# Altium project MB1605.PrjPcb (part 1 of 7)
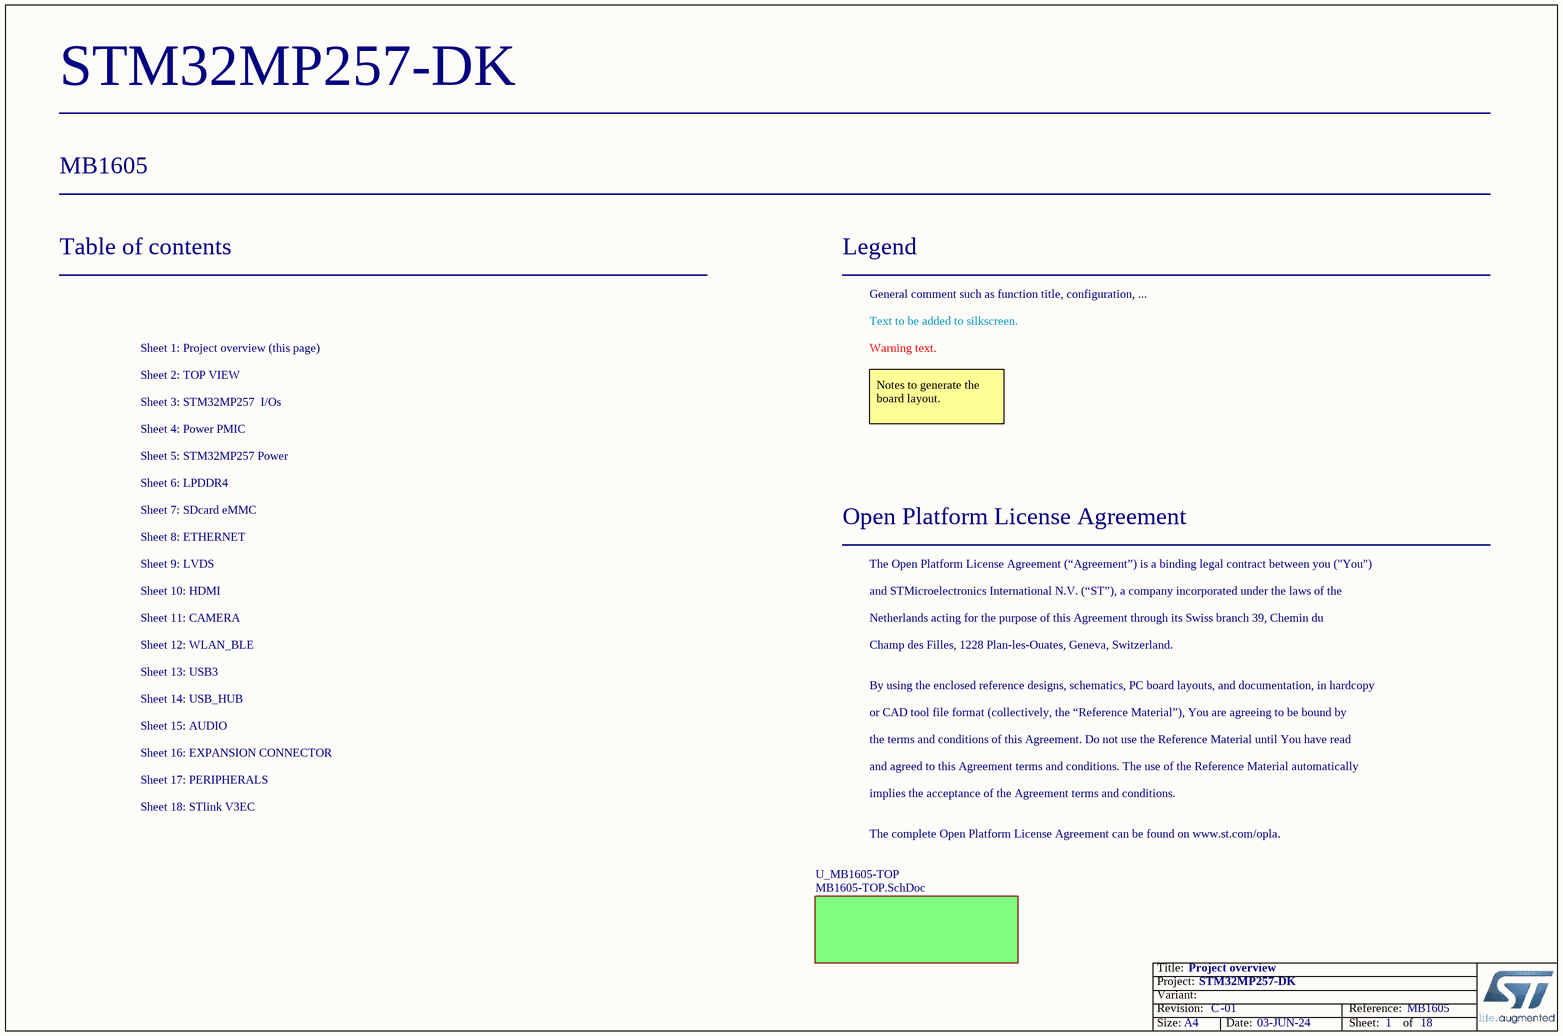
[diagram p0: MB1605_Project_Overview.SchDoc]
Board_Assembly_Revision: 01; Board_Document_Date: 03-JUN-24; Board_Name: STM32MP257-DK; Board_PCB_Revision: C; Board_Reference: MB1605
18 sheets, 641 parts. Net scope: flat (ports and power ports of the same name join across sheets).
Board file: MB1605.PcbDoc
Sheets:
  MB1605_Project_Overview.SchDoc
    U_MB1605-TOP = MB1605-TOP.SchDoc
      U_WLAN_BLUETOOTH = WLAN_BLUETOOTH.SchDoc
      U_Peripherals = Peripherals.SchDoc
      U_MP257_14x14 = MP257_14x14.SchDoc
      U_Power_PMIC = Power_PMIC.SchDoc
      U_Power_MPU = Power_MPU.SchDoc
      U_LVDS = LVDS.SchDoc
      U_STLINK_V3EC = STLINK_V3EC.SchDoc
      U_USB_HUB = USB_HUB.SchDoc
      U_USB3 = USB3.SchDoc
      U_CAMERA = CAMERA.SchDoc
      U_AUDIO = AUDIO.SchDoc
      U_Expansion_Connector = Expansion_Connector.SchDoc
      U_LPDDR4 = LPDDR4.SchDoc
      U_SDcard_eMMC = SDcard_eMMC.SchDoc
      U_ETHERNET = ETHERNET.SchDoc
      U_HDMI = HDMI.SchDoc

## Sheet MB1605_Project_Overview.SchDoc: Project overview
size A4; Date: Not used; ApprovedBy: Not used; CheckedBy: Not used; Author: Not used; CompanyName: STMicroelectronics; DrawnBy: Not used; Engineer: Not used; Organization: Not used; Address1: Not used; Address2: Not used; Address3: Not used; Address4: Not used; DocumentNumber: Not used; Revision: Not used; SheetNumber: 1; SheetTotal: 18; CurrentTime: Not used; CurrentDate: Not used; Time: Not used; DocumentFullPathAndName: Not used; DocumentName: Not used; ModifiedDate: Not used; ImagePath: Not used; ProjectName: Not used; Application_BuildNumber: Not used

### Sub-sheets
U_MB1605-TOP = MB1605-TOP.SchDoc: no entries

### Notes on the sheet
- Table of contents
- Legend
- General comment such as function title, configuration, ...
- Sheet 1: Project overview (this page)
- Sheet 2: TOP VIEW
- Text to be added to silkscreen.
- Warning text.
- Sheet 3: STM32MP257  I/Os
- Sheet 4: Power PMIC
- Notes to generate the board layout.
- Sheet 5: STM32MP257 Power
- Sheet 7: SDcard eMMC
- Sheet 6: LPDDR4
- Sheet 8: ETHERNET
- Sheet 9: LVDS
- Open Platform License Agreement
- The Open Platform License Agreement (“Agreement”) is a binding legal contract between you ("You")
- Sheet 10: HDMI
- Sheet 11: CAMERA
- Sheet 12: WLAN_BLE
- and STMicroelectronics International N.V. (“ST”), a company incorporated under the laws of the
- Netherlands acting for the purpose of this Agreement through its Swiss branch 39, Chemin du
- Champ des Filles, 1228 Plan-les-Ouates, Geneva, Switzerland.
- Sheet 13: USB3
- Sheet 14: USB_HUB
- By using the enclosed reference designs, schematics, PC board layouts, and documentation, in hardcopy
- or CAD tool file format (collectively, the “Reference Material”), You are agreeing to be bound by
- Sheet 17: PERIPHERALS
- Sheet 16: EXPANSION CONNECTOR
- Sheet 15: AUDIO
- the terms and conditions of this Agreement. Do not use the Reference Material until You have read
- and agreed to this Agreement terms and conditions. The use of the Reference Material automatically
- Sheet 18: STlink V3EC
- implies the acceptance of the Agreement terms and conditions.
- The complete Open Platform License Agreement can be found on www.st.com/opla.
- Title:
- Project:
- Size:
- Revision:
- Variant:
- A4
- -
- Date:
- Reference:
- Sheet:
- of

## Sheet MB1605-TOP.SchDoc: MB1605-TOP
size A3; Date: Not used; ApprovedBy: Not used; CheckedBy: Not used; Author: Not used; CompanyName: STMicroelectronics; DrawnBy: Not used; Engineer: Not used; Organization: Not used; Address1: Not used; Address2: Not used; Address3: Not used; Address4: Not used; DocumentNumber: Not used; Revision: Not used; SheetNumber: 2; SheetTotal: 18; CurrentTime: Not used; CurrentDate: Not used; Time: Not used; DocumentFullPathAndName: Not used; DocumentName: Not used; ModifiedDate: Not used; ImagePath: Not used; ProjectName: Not used; Application_BuildNumber: Not used
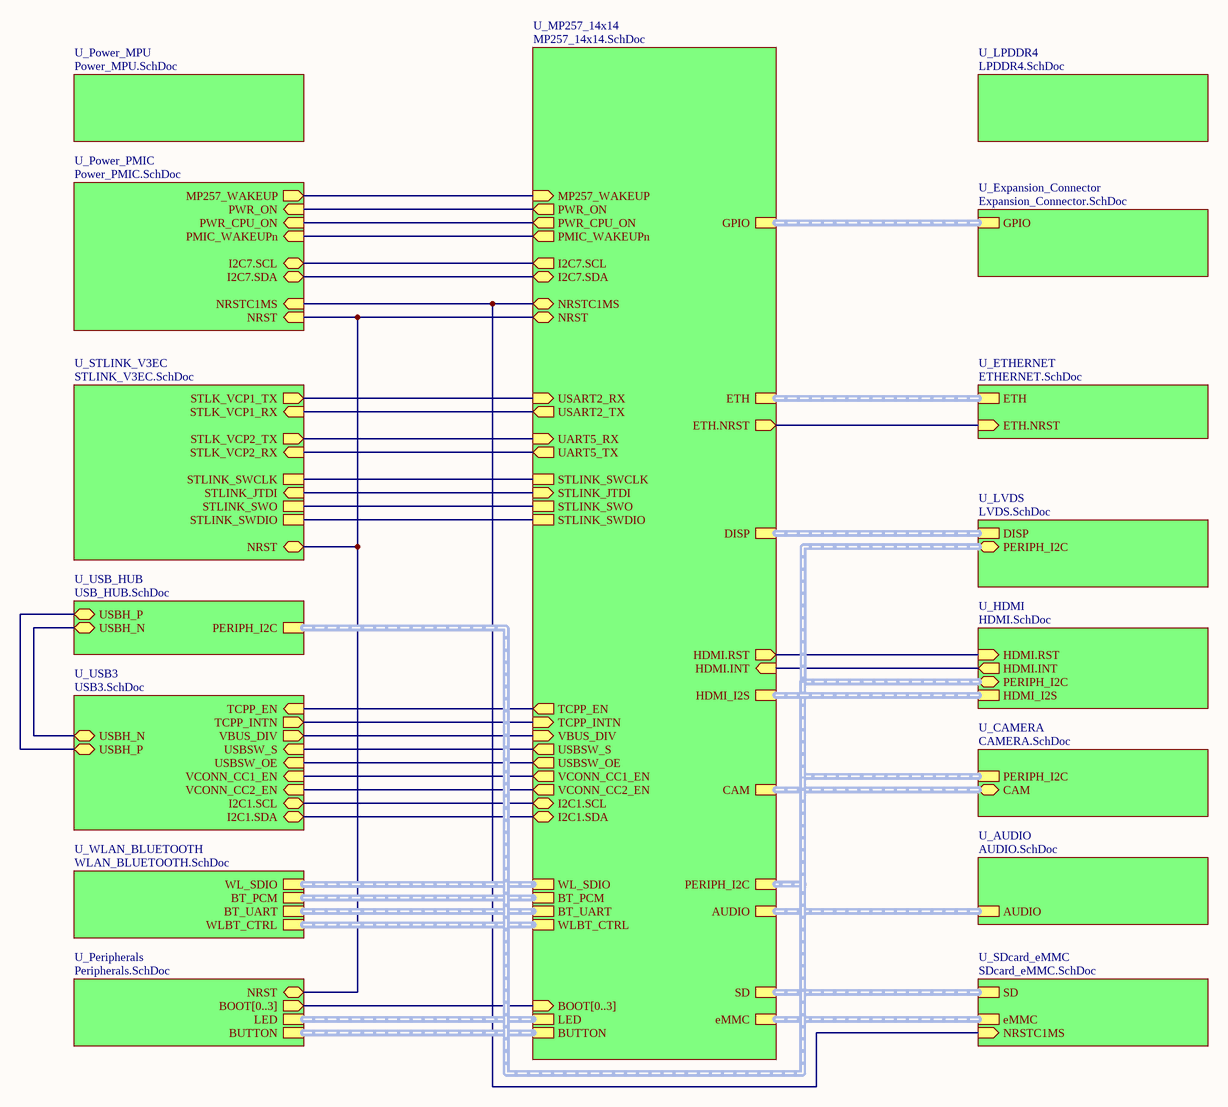
[diagram p1: MB1605-TOP.SchDoc]

### Sub-sheets
U_AUDIO = AUDIO.SchDoc: AUDIO (harness AUDIO)
U_CAMERA = CAMERA.SchDoc: CAM (bidir, harness CAMERA), PERIPH_I2C (harness PERIPH_I2C)
U_ETHERNET = ETHERNET.SchDoc: ETH.NRST (in), ETH (harness ETH1)
U_Expansion_Connector = Expansion_Connector.SchDoc: GPIO (harness GPIO)
U_HDMI = HDMI.SchDoc: HDMI.RST (in), HDMI.INT (out), PERIPH_I2C (bidir, harness PERIPH_I2C), HDMI_I2S (harness HDMI_I2S)
U_LPDDR4 = LPDDR4.SchDoc: no entries
U_LVDS = LVDS.SchDoc: DISP (harness DISP), PERIPH_I2C (bidir, harness PERIPH_I2C)
U_MP257_14x14 = MP257_14x14.SchDoc: NRST (bidir), PWR_ON (out), ETH (harness ETH1), BOOT[0..3] (in), LED (harness LED), BUTTON (harness BUTTON), UART5_TX (out), UART5_RX (in), STLINK_SWCLK, STLINK_JTDI (in), STLINK_SWO, STLINK_SWDIO, USART2_RX (in), NRSTC1MS (bidir), VBUS_DIV (in), TCPP_INTN (in), GPIO (harness GPIO), I2C7.SDA (bidir), I2C7.SCL (out), USART2_TX (out), DISP (harness DISP), PERIPH_I2C (harness PERIPH_I2C), ETH.NRST (out), I2C1.SCL (bidir), HDMI_I2S (harness HDMI_I2S), I2C1.SDA (bidir), PWR_CPU_ON (out), CAM (harness CAMERA), SD (harness SD), WL_SDIO (harness WL_SDIO), BT_PCM (harness BT_PCM), WLBT_CTRL (harness WL_BT_CTRL), BT_UART (harness BT_UART), AUDIO (harness AUDIO), MP257_WAKEUP (in), PMIC_WAKEUPn (out), HDMI.INT (in), HDMI.RST (out), USBSW_OE (out), USBSW_S (out), eMMC (harness eMMC), TCPP_EN (out), VCONN_CC1_EN (out), VCONN_CC2_EN (out)
U_Peripherals = Peripherals.SchDoc: NRST (bidir), BOOT[0..3] (out), LED (harness LED), BUTTON (harness BUTTON)
U_Power_MPU = Power_MPU.SchDoc: no entries
U_Power_PMIC = Power_PMIC.SchDoc: PMIC_WAKEUPn (in), NRST (in), I2C7.SCL (bidir), PWR_ON (in), PWR_CPU_ON (in), NRSTC1MS (in), I2C7.SDA (bidir), MP257_WAKEUP (out)
U_SDcard_eMMC = SDcard_eMMC.SchDoc: SD (harness SD), eMMC (harness eMMC), NRSTC1MS (in)
U_STLINK_V3EC = STLINK_V3EC.SchDoc: NRST (bidir), STLK_VCP2_TX (out), STLK_VCP2_RX (in), STLK_VCP1_TX (out), STLK_VCP1_RX (in), STLINK_SWO, STLINK_SWDIO, STLINK_SWCLK, STLINK_JTDI (in)
U_USB3 = USB3.SchDoc: TCPP_INTN (out), I2C1.SDA (bidir), I2C1.SCL (bidir), VBUS_DIV (out), USBH_P (bidir), USBH_N (bidir), USBSW_OE (in), USBSW_S (in), TCPP_EN (in), VCONN_CC1_EN (in), VCONN_CC2_EN (in)
U_USB_HUB = USB_HUB.SchDoc: USBH_P (bidir), USBH_N (bidir), PERIPH_I2C (harness PERIPH_I2C)
U_WLAN_BLUETOOTH = WLAN_BLUETOOTH.SchDoc: BT_PCM (harness BT_PCM), BT_UART (harness BT_UART), WL_SDIO (harness WL_SDIO), WLBT_CTRL (harness WL_BT_CTRL)

### Nets
(unnamed): sheet U_Peripherals/NRST, sheet U_MP257_14x14/NRST, sheet U_Power_PMIC/NRST, sheet U_STLINK_V3EC/NRST
(unnamed): sheet U_MP257_14x14/PWR_ON, sheet U_Power_PMIC/PWR_ON
(unnamed): sheet U_MP257_14x14/UART5_TX, sheet U_STLINK_V3EC/STLK_VCP2_RX
(unnamed): sheet U_MP257_14x14/UART5_RX, sheet U_STLINK_V3EC/STLK_VCP2_TX
(unnamed): sheet U_MP257_14x14/STLINK_SWCLK, sheet U_STLINK_V3EC/STLINK_SWCLK
(unnamed): sheet U_MP257_14x14/STLINK_JTDI, sheet U_STLINK_V3EC/STLINK_JTDI
(unnamed): sheet U_MP257_14x14/STLINK_SWO, sheet U_STLINK_V3EC/STLINK_SWO
(unnamed): sheet U_MP257_14x14/STLINK_SWDIO, sheet U_STLINK_V3EC/STLINK_SWDIO
(unnamed): sheet U_MP257_14x14/USART2_RX, sheet U_STLINK_V3EC/STLK_VCP1_TX
(unnamed): sheet U_MP257_14x14/NRSTC1MS, sheet U_Power_PMIC/NRSTC1MS, sheet U_SDcard_eMMC/NRSTC1MS
(unnamed): sheet U_MP257_14x14/VBUS_DIV, sheet U_USB3/VBUS_DIV
(unnamed): sheet U_MP257_14x14/TCPP_INTN, sheet U_USB3/TCPP_INTN
(unnamed): sheet U_MP257_14x14/I2C7.SDA, sheet U_Power_PMIC/I2C7.SDA
(unnamed): sheet U_MP257_14x14/I2C7.SCL, sheet U_Power_PMIC/I2C7.SCL
(unnamed): sheet U_MP257_14x14/USART2_TX, sheet U_STLINK_V3EC/STLK_VCP1_RX
(unnamed): sheet U_MP257_14x14/ETH.NRST, sheet U_ETHERNET/ETH.NRST
(unnamed): sheet U_MP257_14x14/I2C1.SCL, sheet U_USB3/I2C1.SCL
(unnamed): sheet U_MP257_14x14/I2C1.SDA, sheet U_USB3/I2C1.SDA
(unnamed): sheet U_MP257_14x14/PWR_CPU_ON, sheet U_Power_PMIC/PWR_CPU_ON
(unnamed): sheet U_MP257_14x14/MP257_WAKEUP, sheet U_Power_PMIC/MP257_WAKEUP
(unnamed): sheet U_MP257_14x14/PMIC_WAKEUPn, sheet U_Power_PMIC/PMIC_WAKEUPn
(unnamed): sheet U_MP257_14x14/HDMI.INT, sheet U_HDMI/HDMI.INT
(unnamed): sheet U_MP257_14x14/HDMI.RST, sheet U_HDMI/HDMI.RST
(unnamed): sheet U_MP257_14x14/USBSW_OE, sheet U_USB3/USBSW_OE
(unnamed): sheet U_MP257_14x14/USBSW_S, sheet U_USB3/USBSW_S
(unnamed): sheet U_MP257_14x14/TCPP_EN, sheet U_USB3/TCPP_EN
(unnamed): sheet U_MP257_14x14/VCONN_CC1_EN, sheet U_USB3/VCONN_CC1_EN
(unnamed): sheet U_MP257_14x14/VCONN_CC2_EN, sheet U_USB3/VCONN_CC2_EN
(unnamed): sheet U_USB_HUB/USBH_P, sheet U_USB3/USBH_P
(unnamed): sheet U_USB_HUB/USBH_N, sheet U_USB3/USBH_N

### Buses and harness runs
bus sheet U_MP257_14x14/BOOT[0..3] = sheet U_Peripherals/BOOT[0..3]
harness sheet U_AUDIO/AUDIO = sheet U_MP257_14x14/AUDIO
harness sheet U_CAMERA/CAM = sheet U_MP257_14x14/CAM
harness sheet U_CAMERA/PERIPH_I2C = sheet U_HDMI/PERIPH_I2C = sheet U_LVDS/PERIPH_I2C = sheet U_MP257_14x14/PERIPH_I2C = sheet U_USB_HUB/PERIPH_I2C
harness sheet U_ETHERNET/ETH = sheet U_MP257_14x14/ETH
harness sheet U_Expansion_Connector/GPIO = sheet U_MP257_14x14/GPIO
harness sheet U_HDMI/HDMI_I2S = sheet U_MP257_14x14/HDMI_I2S
harness sheet U_LVDS/DISP = sheet U_MP257_14x14/DISP
harness sheet U_MP257_14x14/BT_PCM = sheet U_WLAN_BLUETOOTH/BT_PCM
harness sheet U_MP257_14x14/BT_UART = sheet U_WLAN_BLUETOOTH/BT_UART
harness sheet U_MP257_14x14/BUTTON = sheet U_Peripherals/BUTTON
harness sheet U_MP257_14x14/eMMC = sheet U_SDcard_eMMC/eMMC
harness sheet U_MP257_14x14/LED = sheet U_Peripherals/LED
harness sheet U_MP257_14x14/SD = sheet U_SDcard_eMMC/SD
harness sheet U_MP257_14x14/WL_SDIO = sheet U_WLAN_BLUETOOTH/WL_SDIO
harness sheet U_MP257_14x14/WLBT_CTRL = sheet U_WLAN_BLUETOOTH/WLBT_CTRL

### Notes on the sheet
- Title:
- Project:
- Size:
- Revision:
- Variant:
- A3
- -
- Date:
- Reference:
- Sheet:
- of

## Sheet WLAN_BLUETOOTH.SchDoc: WLAN_BLUETOOTH
size A4; Date: 21-MAR-2018; Author: A.B; CompanyName: STMicroelectronics; Organization: MCD/TOOLS/GNB; Address1: 12, Rue Jules HOROWITZ; Address2: 38019 Grenoble; Address3: FRANCE; DocumentNumber: MB1605; Revision: B-01; SheetNumber: 12; SheetTotal: 18; Project: STM32MP257
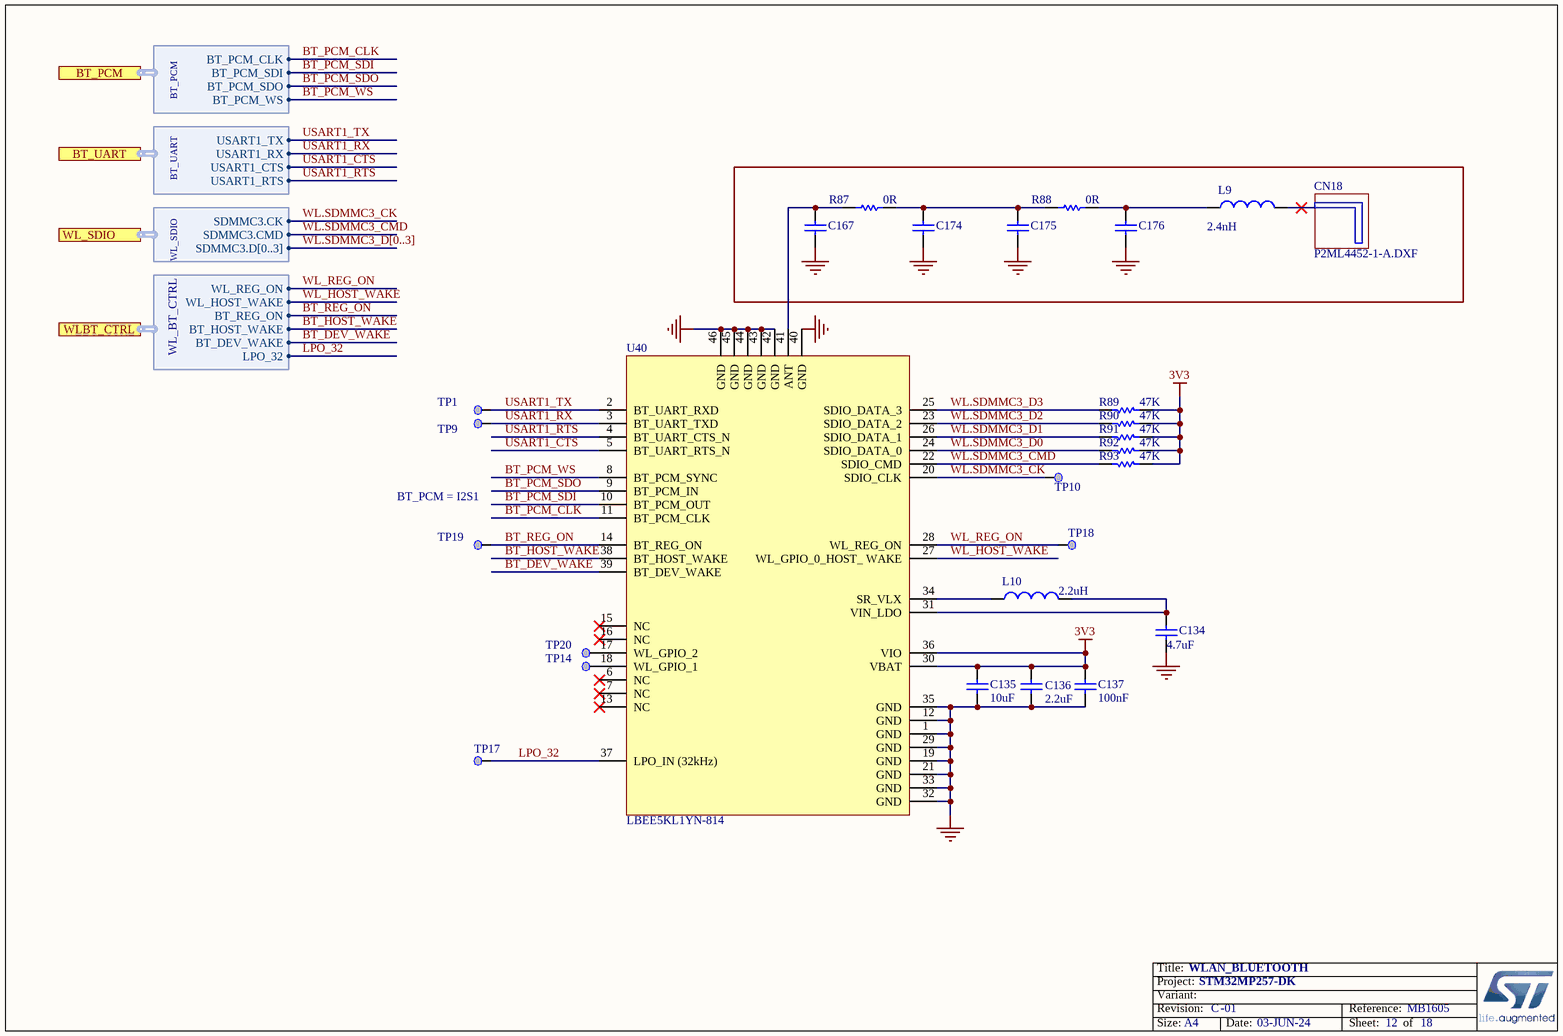
[diagram p2: WLAN_BLUETOOTH.SchDoc]

### Parts
C134  value 4.7uF  [C0402]  (hidden comment: Capacitor)
C135  value 10uF  [C0603]  (hidden comment: Capacitor)
C136  value 2.2uF  [C0603]  (hidden comment: Capacitor)
C137  value 100nF  [C0402]
C167  Capacitor  [C0402]  (value not drawn)
C174  Capacitor  [C0402]  (value not drawn)
C175  Capacitor  [C0402]  (value not drawn)
C176  Capacitor  [C0402]  (value not drawn)
CN18  value P2ML4452-1-A.DXF  [ANT_MURATA_TYPE-1-DX_P2ML4452-1-A_DXF]  (hidden comment: antenna_Wifi_BLE_Murata)  (no BOM)
L9  value 2.4nH  [IND_0402_MURATA_LQW15AN2N4C00X]  (hidden comment: Inductor)
L10  value 2.2uH  [L0603]  (hidden comment: Inductor)
R87  value 0R  [R0402]  (hidden comment: Resistor)
R88  value 0R  [R0402]  (hidden comment: Resistor)
R89  value 47K  [R0402]  (hidden comment: Resistor)
R90  value 47K  [R0402]  (hidden comment: Resistor)
R91  value 47K  [R0402]  (hidden comment: Resistor)
R92  value 47K  [R0402]  (hidden comment: Resistor)
R93  value 47K  [R0402]  (hidden comment: Resistor)
TP1  Test Point  [TP_SMD_0-6MM]  (value not drawn)  (no BOM)
TP9  Test Point  [TP_SMD_0-6MM]  (value not drawn)  (no BOM)
TP10  Test Point  [TP_SMD_0-6MM]  (value not drawn)  (no BOM)
TP14  Test Point  [TP_SMD_0-6MM]  (value not drawn)  (no BOM)
TP17  Test Point  [TP_SMD_0-6MM]  (value not drawn)  (no BOM)
TP18  Test Point  [TP_SMD_0-6MM]  (value not drawn)  (no BOM)
TP19  Test Point  [TP_SMD_0-6MM]  (value not drawn)  (no BOM)
TP20  Test Point  [TP_SMD_0-6MM]  (value not drawn)  (no BOM)
U40  LBEE5KL1YN-814  [MOD_WLAN-BT_MURATA_LBEE5KL1YN-814]

### Ports
BT_PCM (harness BT_PCM), BT_UART (harness BT_UART), WL_SDIO (harness WL_SDIO), WLBT_CTRL (harness WL_BT_CTRL)

### Harnesses
BT_PCM: BT_PCM_CLK, BT_PCM_SDI, BT_PCM_SDO, BT_PCM_WS
BT_UART: USART1_TX, USART1_RX, USART1_CTS, USART1_RTS
WL_SDIO: SDMMC3.CMD, SDMMC3.CK, SDMMC3.D[0..3]
WL_BT_CTRL: WL_REG_ON, WL_HOST_WAKE, BT_REG_ON, BT_HOST_WAKE, BT_DEV_WAKE, LPO_32

### Nets
3V3: C135.2 C136.2 C137.2 R89.1 R90.1 R91.1 R92.1 R93.1 U40.30(VBAT) U40.36(VIO)
GND: C134.1 C135.1 C136.1 C137.1 C167.1 C174.1 C175.1 C176.1 U40.1(GND) U40.12(GND) U40.19(GND) U40.21(GND) U40.29(GND) U40.32(GND) U40.33(GND) U40.35(GND) U40.40(GND) U40.42(GND) U40.43(GND) U40.44(GND) U40.45(GND) U40.46(GND)
BT_DEV_WAKE: U40.39(BT_DEV_WAKE) ; port WLBT_CTRL.BT_DEV_WAKE
BT_HOST_WAKE: U40.38(BT_HOST_WAKE) ; port WLBT_CTRL.BT_HOST_WAKE
BT_PCM_CLK: U40.11(BT_PCM_CLK) ; port BT_PCM.BT_PCM_CLK
BT_PCM_SDI: U40.10(BT_PCM_OUT) ; port BT_PCM.BT_PCM_SDI
BT_PCM_SDO: U40.9(BT_PCM_IN) ; port BT_PCM.BT_PCM_SDO
BT_PCM_WS: U40.8(BT_PCM_SYNC) ; port BT_PCM.BT_PCM_WS
BT_REG_ON: TP19.1 U40.14(BT_REG_ON) ; port WLBT_CTRL.BT_REG_ON
LPO_32: TP17.1 U40.37(LPO_IN_(32kHz)) ; port WLBT_CTRL.LPO_32
USART1_CTS: U40.5(BT_UART_RTS_N) ; port BT_UART.USART1_CTS
USART1_RTS: U40.4(BT_UART_CTS_N) ; port BT_UART.USART1_RTS
USART1_RX: TP9.1 U40.3(BT_UART_TXD) ; port BT_UART.USART1_RX
USART1_TX: TP1.1 U40.2(BT_UART_RXD) ; port BT_UART.USART1_TX
WL.SDMMC3_CK: TP10.1 U40.20(SDIO_CLK) ; port WL_SDIO.SDMMC3.CK
WL.SDMMC3_CMD: R93.2 U40.22(SDIO_CMD) ; port WL_SDIO.SDMMC3.CMD
WL.SDMMC3_D0: R92.2 U40.24(SDIO_DATA_0)
WL.SDMMC3_D1: R91.2 U40.26(SDIO_DATA_1)
WL.SDMMC3_D2: R90.2 U40.23(SDIO_DATA_2)
WL.SDMMC3_D3: R89.2 U40.25(SDIO_DATA_3)
WL_HOST_WAKE: U40.27(WL_GPIO_0_HOST__WAKE) ; port WLBT_CTRL.WL_HOST_WAKE
WL_REG_ON: TP18.1 U40.28(WL_REG_ON) ; port WLBT_CTRL.WL_REG_ON
NetC134_2: C134.2 L10.2 U40.31(VIN_LDO)
NetC167_2: C167.2 R87.2 U40.41(ANT)
NetC174_2: C174.2 C175.2 R87.1 R88.2
NetC176_2: C176.2 L9.1 R88.1
NetL10_1: L10.1 U40.34(SR_VLX)
NetTP14_1: TP14.1 U40.18(WL_GPIO_1)
NetTP20_1: TP20.1 U40.17(WL_GPIO_2)

Not connected (* = marked no-connect by the designer): L9 2*; U40 6(NC)* 7(NC)* 13(NC)* 15(NC)* 16(NC)*

### Buses and harness runs
bus WL.SDMMC3_D[0..3]

### Notes on the sheet
- (near TP19) BT_PCM = I2S1
- Title:
- Project:
- Size:
- Revision:
- Variant:
- A4
- -
- Date:
- Reference:
- Sheet:
- of

### Library data of the parts
C134 = MCD-01356: Capacitor, MLCC, 4.7uF, 6V3, X5R, 20%, 0402, T=0,5mm; Manufacturer_Part_Number: GRM155R60J475ME47; Manufacturer: MURATA; Alternate_Manufacturer_Part_Number: GRM155R60J475ME87; Part_Preference: Recommended; Provided_By: SUBCO; Order_Code_RS: 814-5230; ECCN_EU: NEC; ECCN_US: EAR99; Component_Country_Of_Origin: Japan; ID: 3456; ShowFields: YES; Internal_Part_Number: MCD-01356; ComponentLink1Description: Datasheet; Status: Released; Part_Type: Capacitor; Package: 0402; ComponentLink1URL: http://tunmcdsvn.tun.st.com/Component_Documentation_Library/Trunk/Capacitor/MURATA_GRM_Series; Alternate_Manufacturer: MURATA; Order_Code_Digikey: 490-5915-1-ND; Order_Code_Farnell: 2666407
C135 = MCD-00099: Capacitor, MLCC, 10uF, 10V, X5R, 10%, 0603, T=0,8mm; Manufacturer_Part_Number: GRM188R61A106KE69D; Manufacturer: MURATA; Part_Preference: Recommended; ECCN_US: EAR99; ECCN_EU: NEC; Provided_By: SUBCO; Initial_Board_Reference: MB1262; Order_Code_RS: 170-6168; Component_Country_Of_Origin: Japan; ID: 2770; ShowFields: YES; Internal_Part_Number: MCD-00099; Status: Released; Part_Type: Capacitor; Package: 0603; ComponentLink1Description: Datasheet; ComponentLink1URL: http://tunmcdsvn.tun.st.com/Component_Documentation_Library/Trunk/Capacitor/MURATA_GRM_Series; Order_Code_Digikey: 490-10474-1-ND; Order_Code_Farnell: 2494233
C136 = MCD-00012: Capacitor, MLCC, 2.2uF, 10V, X5R, 10%, 0603, T=0,8mm; Manufacturer_Part_Number: CC0603KRX5R6BB225; Manufacturer: YAGEO; Alternate_Manufacturer_Part_Number: C0603C225K8PACTU; Alternate_Manufacturer: KEMET; BMS_Part_Number: 9142010; Part_Preference: Recommended; ECCN_US: EAR99; ECCN_EU: NEC; Provided_By: SUBCO; Initial_Board_Reference: MB1274; Component_Country_Of_Origin: China; ID: 2467; ShowFields: YES; Internal_Part_Number: MCD-00012; ComponentLink1Description: Datasheet; Status: Released; Part_Type: Capacitor; Package: 0603; ComponentLink1URL: http://tunmcdsvn.tun.st.com/Component_Documentation_Library/Trunk/Capacitor/YAGEO_X5R_Series; Order_Code_Digikey: 311-1451-1-ND; Order_Code_Farnell: 2370679; Order_Code_RS: N/A
C137 = MCD-00006: Capacitor,100nF,16V,X7R,10%,0402; Manufacturer_Part_Number: CC0402KRX7R7BB104; Manufacturer: YAGEO; Alternate_Manufacturer: MURATA; Alternate_Manufacturer_Part_Number: GCM155R71C104KA55D; Part_Preference: Recommended; Partial_Alternate_Internal_Part_Number: MCD-03299; ECCN_US: EAR99; ECCN_EU: NEC; Provided_By: SUBCO; Initial_Board_Reference: MB1274; Order_Code_RS: 616-9701; Component_Country_Of_Origin: China; ID: 2474; ShowFields: YES; Alternate_EMS: M; Internal_Part_Number: MCD-00006; ComponentLink1Description: Datasheet; Status: Released; Part_Type: Capacitor; Package: 0402; ComponentLink1URL: http://tunmcdsvn.tun.st.com/Component_Documentation_Library/Trunk/Capacitor/YAGEO_X7R_Series; Order_Code_Digikey: 311-1338-1-ND; Order_Code_Farnell: 9402047
C167 C174-C176 = MCD-00200: Capacitor, MLCC, 12pF, 50V, NPO, 5%, 0402, T=0,5mm; Manufacturer_Part_Number: CC0402JRNPO9BN120; Manufacturer: YAGEO; Part_Preference: Recommended; Provided_By: SUBCO; ECCN_EU: NEC; ECCN_US: EAR99; Component_Country_Of_Origin: China; ID: 2667; ShowFields: YES; Internal_Part_Number: MCD-00200; Value: 12pF; Status: Checked; Part_Type: Capacitor; Package: 0402; ComponentLink1Description: Datasheet; ComponentLink1URL: http://tunmcdsvn.tun.st.com/Component_Documentation_Library/Trunk/Capacitor/YAGEO_NP0_Series; Alternate_Manufacturer: N/A; Alternate_Manufacturer_Part_Number: N/A; Order_Code_Digikey: 311-1016-1-ND; Order_Code_Farnell: 2370624; Order_Code_RS: N/A
CN18 = MCD-00656: Murata_Type1DX_AntennaDesign_P2ML4452-1-A.DXF; Part_Type: Misc; Manufacturer: MURATA; Part_Preference: Recommended; Initial_Board_Reference: MB1272; Component_Country_Of_Origin: Unknown; ID: 3086; ShowFields: YES; Internal_Part_Number: MCD-00656; Status: New; Manufacturer_Part_Number: Antenna design; ComponentLink1Description: Datasheet; ComponentLink1URL: http://tunmcdsvn.tun.st.com/Component_Datasheet_Library/Trunk/Misc/Murata_Type1DX_AntennaDesign_20160311; ECCN_US: n/a; ECCN_EU: n/a; Provided_By: n/a; Order_Code_Digikey: N/A; Order_Code_Farnell: N/A; Order_Code_RS: N/A; Package: N/A
L9 = MCD-00657: Inductor,2.4nH,+-0.2nH,0.05R,0.85A,0402; Manufacturer_Part_Number: LQW15AN2N4C00#; Manufacturer: MURATA; Part_Preference: Recommended; Provided_By: SUBCO; Initial_Board_Reference: MB1272; Order_Code_RS: 177-6240; Component_Country_Of_Origin: Japan; ID: 3088; ShowFields: YES; Internal_Part_Number: MCD-00657; Status: Checked; Part_Type: Inductor; Package: 0402; ComponentLink1Description: Datasheet; ComponentLink1URL: http://tunmcdsvn.tun.st.com/Component_Documentation_Library/Trunk/Inductor/MURATA_LQW15ANx_Series; ECCN_US: n/a; ECCN_EU: n/a; Order_Code_Digikey: N/A; Order_Code_Farnell: N/A
L10 = MCD-00659: Inductor, 2.2µH, 20%, Isat 0.35A, DCR 0.2Ohm, 0603; Manufacturer_Part_Number: LQM18PN2R2MGH; Manufacturer: MURATA; Part_Preference: Recommended; Provided_By: SUBCO; Initial_Board_Reference: MB1272; Component_Country_Of_Origin: Japan; ID: 3085; ShowFields: YES; Internal_Part_Number: MCD-00659; Status: Checked; Part_Type: Inductor; Package: 0603; ComponentLink1Description: Datasheet; ComponentLink1URL: http://tunmcdsvn.tun.st.com/Component_Documentation_Library/Trunk/Inductor/MURATA_LQM_Series; ECCN_US: n/a; ECCN_EU: n/a; Order_Code_Digikey: 490-14478-1-ND; Order_Code_Farnell: N/A; Order_Code_RS: N/A
R87 R88 = MCD-00052: Resistor,0R,0402,5%,1/16W; Manufacturer_Part_Number: RC0402JR-070RL; Manufacturer: YAGEO; Part_Preference: Recommended; ECCN_US: EAR99; ECCN_EU: NEC; Provided_By: SUBCO; Initial_Board_Reference: MB1274; Order_Code_RS: 618-5804; Component_Country_Of_Origin: China; ID: 2540; ShowFields: YES; Internal_Part_Number: MCD-00052; Status: Released; Part_Type: Resistor; Package: 0402; ComponentLink1Description: Datasheet; ComponentLink1URL: http://tunmcdsvn.tun.st.com/Component_Documentation_Library/Trunk/Resistor/YAGEO_RC_L_Series; Order_Code_Digikey: 311-0.0JRCT-ND; Order_Code_Farnell: 9232516RL
R89-R93 = MCD-00063: Resistor,47K,0402,1%,1/16W; Manufacturer_Part_Number: RC0402FR-0747KL; Manufacturer: YAGEO; Part_Preference: Recommended; ECCN_US: EAR99; ECCN_EU: NEC; Provided_By: SUBCO; Initial_Board_Reference: MB1274; Component_Country_Of_Origin: China; ID: 2528; ShowFields: YES; Internal_Part_Number: MCD-00063; ComponentLink1Description: Datasheet; Status: Released; Part_Type: Resistor; ComponentLink1URL: http://tunmcdsvn.tun.st.com/Component_Documentation_Library/Trunk/Resistor/YAGEO_RC_L_Series; Package: 0402; Order_Code_Digikey: 311-47.0KLRCT-ND; Order_Code_Farnell: 9239430; Order_Code_RS: N/A
TP1 TP9 TP10 TP14 TP17-TP20 = MCD-00631: Test Point 0.6mm; Part_Type: Misc; Part_Preference: Recommended; Initial_Board_Reference: MB1264; ID: 3108; ShowFields: YES; Internal_Part_Number: MCD-00631; Status: Released; ECCN_US: n/a; ECCN_EU: n/a; Provided_By: n/a; ComponentLink1Description: Datasheet; Manufacturer: N/A; Manufacturer_Part_Number: N/A; Order_Code_Digikey: N/A; Order_Code_Farnell: N/A; Order_Code_RS: N/A
U40 = MCD-03465: IC, IEEE802.11b/g/n W-LAN + Bluetooth 5.2(BR/EDR/BLE) module; Part_Preference: Recommended; Manufacturer: MURATA; Component_Country_Of_Origin: China°; ShowFields: YES; ID: 5581; Internal_Part_Number: MCD-03465; Value: LBEE5KL1YN-814; Status: New; Part_Type: IC; Manufacturer_Part_Number: LBEE5KL1YN-814; ComponentLink1URL: http://tunmcdsvn.tun.st.com/Component_Documentation_Library/Trunk/IC/MURATA_LBEE5KL1YN; Order_Code_Digikey: 490-LBEE5KL1YN-814TR-ND; Order_Code_Farnell: 4035662; Order_Code_RS: N/A

## Sheet Peripherals.SchDoc: Peripherals
size A4; Date: 01-DEC-2013; CompanyName: STMicroelectronics; Organization: Microcontrollers Division; Address1: 12, Rue Jules HOROWITZ; Address2: 38019 Grenoble; Address3: FRANCE; DocumentNumber: MB1272; Revision: A-01; SheetNumber: 17; SheetTotal: 18; Project: STM32MP15-DISCO PI
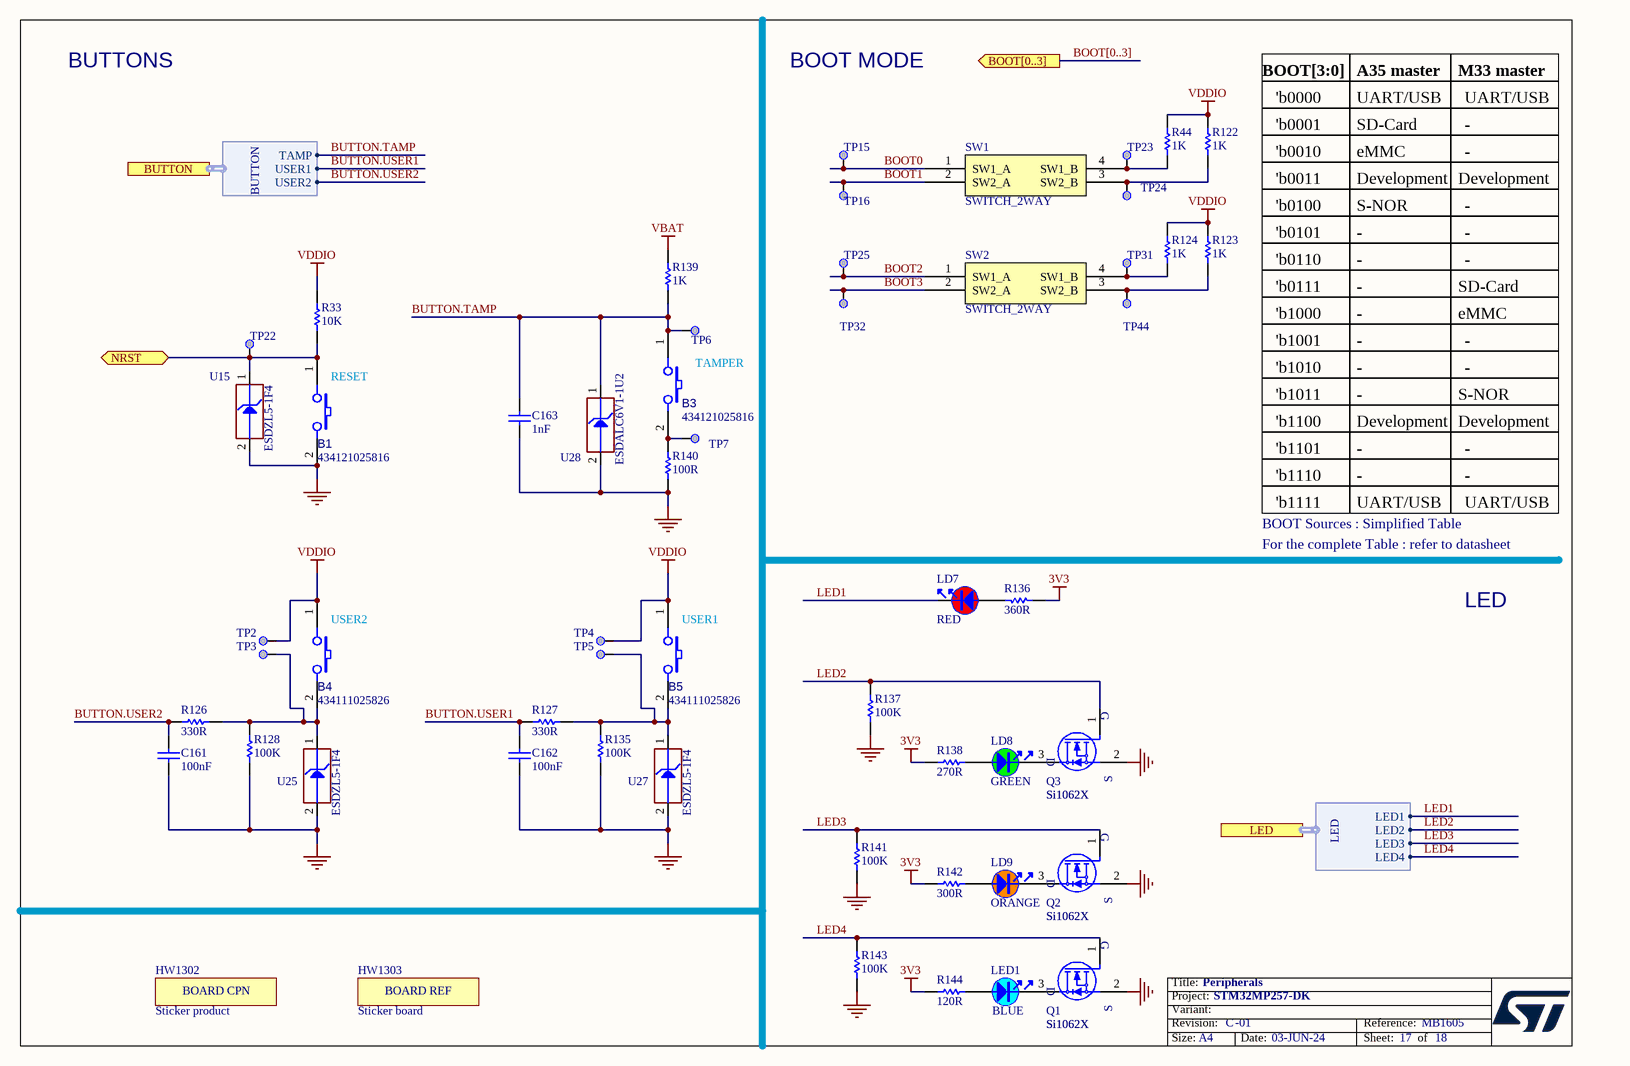
[diagram p3: Peripherals.SchDoc]

### Parts
B1  value 434121025816  [SWI_WE_434121025816]  (hidden comment: SW_PUSH_SMD_2P)
B3  value 434121025816  [SWI_WE_434121025816]  (hidden comment: SW_PUSH_SMD_2P)
B4  value 434111025826  [SWI_WE_4341x10258x6]  (hidden comment: SW_PUSH_SMD_2P)
B5  value 434111025826  [SWI_WE_4341x10258x6]  (hidden comment: SW_PUSH_SMD_2P)
C161  value 100nF  [C0402]  (hidden comment: Capacitor)
C162  value 100nF  [C0402]  (hidden comment: Capacitor)
C163  value 1nF  [C0402]  (hidden comment: Capacitor)
HW1302  value Sticker product  [STICKER_BOARD-CPN_25X5]  (hidden comment: ​PCH W35 footprint requested to have a space on board for stickers.)  (mechanical)
HW1303  value Sticker board  [STICKER_BOARD-REF_25X5]  (hidden comment: STICKER_BOARD_REF)  (mechanical)
LD7  value RED  [LED_0603_VISHAY_VLMS1300-GS08_RED_1A2K_H0P8]  (hidden comment: LED_red)
LD8  value GREEN  [LED_0603_OSRAM_LG-Q396-PS-35_GREEN_1A2K_H0P4]  (hidden comment: LED_green)
LD9  value ORANGE  [LED_0603_OSRAM_LO-Q976-PS-25_ORANGE_1A2K_H0P8]  (hidden comment: LED_orange)
LED1  value BLUE  [LED_0603_OSRAM_LB-Q39G-L2OO-35-1_BLUE_1A2K_H0P4]
Q1  value Si1062X  Manufacturer_Part_Number: Si1062X  [MOS_SC89-3L]  (hidden comment: MOSFET_N-CHANNEL)
Q2  value Si1062X  Manufacturer_Part_Number: Si1062X  [MOS_SC89-3L]  (hidden comment: MOSFET_N-CHANNEL)
Q3  value Si1062X  Manufacturer_Part_Number: Si1062X  [MOS_SC89-3L]  (hidden comment: MOSFET_N-CHANNEL)
R33  value 10K  [R0402]  (hidden comment: Resistor)
R44  value 1K  [R0402]  (hidden comment: Resistor)
R122  value 1K  [R0402]  (hidden comment: Resistor)
R123  value 1K  [R0402]  (hidden comment: Resistor)
R124  value 1K  [R0402]  (hidden comment: Resistor)
R126  value 330R  [R0402]  (hidden comment: Resistor)
R127  value 330R  [R0402]  (hidden comment: Resistor)
R128  value 100K  [R0402]  (hidden comment: Resistor)
R135  value 100K  [R0402]  (hidden comment: Resistor)
R136  value 360R  [R0402]  (hidden comment: Resistor)
R137  value 100K  [R0402]  (hidden comment: Resistor)
R138  value 270R  [R0402]  (hidden comment: Resistor)
R139  value 1K  [R0402]  (hidden comment: Resistor)
R140  value 100R  [R0402]  (hidden comment: Resistor)
R141  value 100K  [R0402]  (hidden comment: Resistor)
R142  value 300R  [R0402]  (hidden comment: Resistor)
R143  value 100K  [R0402]  (hidden comment: Resistor)
R144  value 120R  [R0402]
SW1  SWITCH_2WAY  [SWI_C&K_SDA02H1SBD_2POS]
SW2  SWITCH_2WAY  [SWI_C&K_SDA02H1SBD_2POS]
TP2  Test Point  [TP_SMD_1MM]  (value not drawn)  (no BOM)
TP3  Test Point  [TP_SMD_1MM]  (value not drawn)  (no BOM)
TP4  Test Point  [TP_SMD_1MM]  (value not drawn)  (no BOM)
TP5  Test Point  [TP_SMD_1MM]  (value not drawn)  (no BOM)
TP6  Test Point  [TP_SMD_1MM]  (value not drawn)  (no BOM)
TP7  Test Point  [TP_SMD_1MM]  (value not drawn)  (no BOM)
TP15  Test Point  [TP_SMD_1MM]  (value not drawn)  (no BOM)
TP16  Test Point  [TP_SMD_1MM]  (value not drawn)  (no BOM)
TP22  Test Point  [TP_SMD_1MM]  (value not drawn)  (no BOM)
TP23  Test Point  [TP_SMD_1MM]  (value not drawn)  (no BOM)
TP24  Test Point  [TP_SMD_1MM]  (value not drawn)  (no BOM)
TP25  Test Point  [TP_SMD_1MM]  (value not drawn)  (no BOM)
TP31  Test Point  [TP_SMD_1MM]  (value not drawn)  (no BOM)
TP32  Test Point  [TP_SMD_1MM]  (value not drawn)  (no BOM)
TP44  Test Point  [TP_SMD_1MM]  (value not drawn)  (no BOM)
U15  value ESDZL5-1F4  [ESD_ST0201]  (hidden comment: ESD-TRANSIL)
U25  value ESDZL5-1F4  [ESD_ST0201]  (hidden comment: ESD-TRANSIL)
U27  value ESDZL5-1F4  [ESD_ST0201]  (hidden comment: ESD-TRANSIL)
U28  value ESDALC6V1-1U2  [ESD_ST0201]  (hidden comment: ESD-TRANSIL)

### Ports
BOOT[0..3] (out), BUTTON (harness BUTTON), LED (harness LED), NRST (bidir)

### Harnesses
BUTTON: TAMP, USER1, USER2
LED: LED1, LED2, LED3, LED4

### Nets
3V3: R136.1 R138.2 R142.2 R144.1
GND: B1.2 C161.1 C162.1 C163.1 Q1.2(S) Q2.2(S) Q3.2(S) R128.1 R135.1 R137.1 R140.2 R141.1 R143.1 U15.2(GND) U25.2(GND) U27.2(GND) U28.2(GND)
VBAT: R139.2
VDDIO: B4.1 B5.1 R33.2 R44.2 R122.2 R123.2 R124.2 TP2.1 TP4.1
BOOT0: SW1.1(SW1_A) TP15.1
BOOT1: SW1.2(SW2_A) TP16.1
BOOT2: SW2.1(SW1_A) TP25.1
BOOT3: SW2.2(SW2_A) TP32.1
BUTTON.TAMP: B3.1 C163.2 R139.1 TP6.1 U28.1(IO1) ; port BUTTON.TAMP
BUTTON.USER1: C162.2 R127.1 ; port BUTTON.USER1
BUTTON.USER2: C161.2 R126.1 ; port BUTTON.USER2
LED1: LD7.2 ; port LED.LED1
LED2: Q3.1(G) R137.2 ; port LED.LED2
LED3: Q2.1(G) R141.2 ; port LED.LED3
LED4: Q1.1(G) R143.2 ; port LED.LED4
NRST: B1.1 R33.1 TP22.1 U15.1(IO1) ; port NRST
NetB3_2: B3.2 R140.1 TP7.1
NetB4_2: B4.2 R126.2 R128.2 TP3.1 U25.1(IO1)
NetB5_2: B5.2 R127.2 R135.2 TP5.1 U27.1(IO1)
NetLD7_1: LD7.1 R136.2
NetLD8_1: LD8.1 R138.1
NetLD8_2: LD8.2 Q3.3(D)
NetLD9_1: LD9.1 R142.1
NetLD9_2: LD9.2 Q2.3(D)
NetLED1_1: LED1.1 R144.2
NetLED1_2: LED1.2 Q1.3(D)
NetR44_1: R44.1 SW1.4(SW1_B) TP23.1
NetR122_1: R122.1 SW1.3(SW2_B) TP24.1
NetR123_1: R123.1 SW2.3(SW2_B) TP44.1
NetR124_1: R124.1 SW2.4(SW1_B) TP31.1

### Buses and harness runs
bus BOOT[0..3] = port BOOT[0..3]

### Notes on the sheet
- BUTTONS
- BOOT MODE
- BOOT[3:0]
- 'b0001
- 'b0000
- A35 master
- UART/USB
- SD-Card
- M33 master
- -
- 'b0010
- 'b0011
- eMMC
- Development
- 'b0100
- 'b0101
- 'b0110
- S-NOR
- 'b0111
- 'b1000
- (near B1) RESET
- TAMPER
- 'b1001
- 'b1010
- 'b1011
- 'b1100
- 'b1101
- BOOT Sources : Simplified Table
- 'b1110
- 'b1111
- For the complete Table : refer to datasheet
- (near B4) USER2
- (near B5) USER1
- LED
- Title:
- Project:
- Size:
- Revision:
- Variant:
- A4
- Date:
- Reference:
- Sheet:
- of
- (in symbol MCD-00235) BOARD REF
- (in symbol MCD-00547) BOARD CPN

### Library data of the parts
B1 B3 = MCD-03492: Switch tactile, SPST-NO, 50mA, 12V, 6x3.8mm; Part_Type: Misc; Part_Preference: Recommended; Manufacturer: WURTH ELEKTRONIC; ShowFields: YES; ID: 5608; Component_Country_Of_Origin: China°; Internal_Part_Number: MCD-03492; Status: Checked; Manufacturer_Part_Number: 434121025816; ComponentLink1URL: http://tunmcdsvn.tun.st.com/Component_Documentation_Library/Trunk/Misc/WURTH_ELECTRONIK_434121025816; Order_Code_Digikey: 732-7045-2-ND; Order_Code_Farnell: 1867991; Order_Code_RS: N/A; Package: 6x3.8mm
B4 B5 = MCD-03491: Switch tactile, SPST-NO, 50mA, 12V, 6x3.8mm; Part_Type: Misc; Part_Preference: Recommended; Manufacturer: WURTH ELEKTRONIC; ShowFields: YES; ID: 5607; Component_Country_Of_Origin: China°; Internal_Part_Number: MCD-03491; Status: Checked; Manufacturer_Part_Number: 434111025826; ComponentLink1URL: http://tunmcdsvn.tun.st.com/Component_Documentation_Library/Trunk/Misc/WURTH_ELECTRONIK_434111025826; Order_Code_Digikey: 732-7039-2-ND; Order_Code_Farnell: 1867992; Order_Code_RS: N/A; Package: 6x3.8mm
C161 C162 = MCD-00006: Capacitor, MLCC, 100nF, 16V, X7R, +/-10%, 0402, T=0.5mm; Manufacturer_Part_Number: CC0402KRX7R7BB104; Manufacturer: YAGEO; Part_Preference: Recommended; Alternate_Manufacturer: MURATA; Alternate_Manufacturer_Part_Number: GCM155R71C104KA55D; Partial_Alternate_Internal_Part_Number: MCD-03299; Order_Code_RS: 616-9701; Component_Country_Of_Origin: China; ID: 2474; ShowFields: YES; Alternate_EMS: M; Internal_Part_Number: MCD-00006; Status: Released; Part_Type: Capacitor; Package: 0402; ComponentLink1Description: Datasheet; ComponentLink1URL: http://tunmcdsvn.tun.st.com/Component_Documentation_Library/Trunk/Capacitor/YAGEO_X7R_Series; Order_Code_Digikey: 311-1338-1-ND; Order_Code_Farnell: 9402047
C163 = MCD-00198: Capacitor, MLCC, 1nF, 16V, X7R, +/-10%, 0402, T=0.5mm; Part_Preference: Recommended; Manufacturer: YAGEO; Manufacturer_Part_Number: CC0402KRX7R7BB102; Component_Country_Of_Origin: China; ShowFields: YES; ID: 2665; Internal_Part_Number: MCD-00198; Status: Released; Part_Type: Capacitor; Package: 0402; ComponentLink1URL: http://tunmcdsvn.tun.st.com/Component_Documentation_Library/Trunk/Capacitor/YAGEO_X7R_Series; Order_Code_Digikey: 311-1352-1-ND; Order_Code_Farnell: 2370642; Order_Code_RS: N/A
HW1302 = MCD-00547: Sticker to mention board CPN code; Part_Type: Misc; Part_Preference: Recommended; Provided_By: SUBCO; Initial_Board_Reference: MB1319; ID: 3197; ShowFields: YES; Internal_Part_Number: MCD-00547; Status: Released; Manufacturer_Part_Number: n/a; Manufacturer: n/a; ComponentLink1Description: Datasheet; ComponentLink1URL: N/A; ECCN_US: n/a; ECCN_EU: n/a; Order_Code_Digikey: N/A; Order_Code_Farnell: N/A; Order_Code_RS: N/A
HW1303 = MCD-00235: Sticker to mention board reference + serial number; Part_Type: Misc; Part_Preference: Recommended; Provided_By: SUBCO; Initial_Board_Reference: MB1319; ID: 2632; ShowFields: YES; Internal_Part_Number: MCD-00235; Status: Released; Manufacturer_Part_Number: n/a; Manufacturer: n/a; ComponentLink1Description: Datasheet; ComponentLink1URL: n/a; ECCN_US: n/a; ECCN_EU: n/a; Order_Code_Digikey: N/A; Order_Code_Farnell: N/A; Order_Code_RS: N/A
LD7 = MCD-00587: LED Red, 0603 SMD, 2V Forward Voltage; Part_Type: Display; Manufacturer_Part_Number: VLMS1300-GS08; Manufacturer: VISHAY; Alternate_Manufacturer_Part_Number: LS Q976-NR-1; Alternate_Manufacturer: OSRAM OPTO SEMICONDUCTORS; Alternate_Internal_Part_Number: MCD-02401; Part_Preference: Recommended; Provided_By: SUBCO; Component_Country_Of_Origin: China; ID: 3154; ShowFields: YES; Internal_Part_Number: MCD-00587; Status: Released; Package: LED 0603; ComponentLink1Description: Datasheet; ComponentLink1URL: http://tunmcdsvn.tun.st.com/Component_Documentation_Library/Trunk/Display/VISHAY_VLMx1300-GS08_Series; Order_Code_Digikey: VLMS1300-GS08CT-ND; Order_Code_Farnell: 2078728; ECCN_US: n/a; ECCN_EU: n/a; Order_Code_RS: N/A; Full_Alternate_Internal_Part_Number: MCD-02401
LD8 = MCD-00588: LED Green, 0603 SMD, Forward Voltage Typ=2V, Max=2.5V; Part_Type: Display; Manufacturer_Part_Number: LG Q396-PS-35; Manufacturer: OSRAM OPTO SEMICONDUCTORS; Alternate_Manufacturer_Part_Number: VLMTG1300-GS08; Alternate_Manufacturer: VISHAY SEMICONDUCTOR OPTO DIVISION; Alternate_Internal_Part_Number: MCD-02400; Part_Preference: Recommended; Provided_By: SUBCO; Component_Country_Of_Origin: Unknown; ID: 3155; ShowFields: YES; Internal_Part_Number: MCD-00588; Status: Released; Package: LED 0603; ComponentLink1Description: Datasheet; ComponentLink1URL: http://tunmcdsvn.tun.st.com/Component_Documentation_Library/Trunk/Display/OSRAM_OPTO_SEMICONDUCTORS_LG-Q396-PS-35; Order_Code_Digikey: LG Q396-PS-35-ND; ECCN_US: n/a; ECCN_EU: n/a; Order_Code_Farnell: N/A; Order_Code_RS: N/A; Full_Alternate_Internal_Part_Number: MCD-02400
LD9 = MCD-00590: LED Orange, 0603 SMD, Forward Voltage Min=1.6V, Max=2.4V; Part_Type: Display; Manufacturer_Part_Number: LO Q976-PS-25; Manufacturer: OSRAM OPTO SEMICONDUCTORS; Alternate_Manufacturer_Part_Number: VLMO1300-GS08; Alternate_Manufacturer: VISHAY SEMICONDUCTOR OPTO DIVISION; Part_Preference: Recommended; Provided_By: SUBCO; Component_Country_Of_Origin: Unknown; ID: 3156; ShowFields: YES; Internal_Part_Number: MCD-00590; Status: Released; Package: LED 0603; ComponentLink1Description: Datasheet; ComponentLink1URL: http://tunmcdsvn.tun.st.com/Component_Documentation_Library/Trunk/Display/OSRAM_OPTO_SEMICONDUCTORS_LO-Q976-PS-25; ECCN_US: n/a; ECCN_EU: n/a; Order_Code_Digikey: N/A; Order_Code_Farnell: N/A; Order_Code_RS: N/A
LED1 = MCD-00585: LED Blue, 0603 SMD, Forward Voltage Min=2,8V, Max=3,8V; Part_Type: Display; Manufacturer_Part_Number: LB Q39G-L2OO-35-1; Manufacturer: OSRAM OPTO SEMICONDUCTORS; Alternate_Manufacturer_Part_Number: 19-217-BHC-ZL1M2RY-3T-V4; Alternate_Manufacturer: EVERLIGHT; Alternate_Internal_Part_Number: MCD-02398; Part_Preference: Recommended; Order_Code_RS: 9148643; Provided_By: SUBCO; Component_Country_Of_Origin: Unknown; ID: 3159; ShowFields: YES; Internal_Part_Number: MCD-00585; Status: Released; Package: LED 0603; ComponentLink1Description: Datasheet; ComponentLink1URL: http://tunmcdsvn.tun.st.com/Component_Documentation_Library/Trunk/Display/OSRAM_OPTO_SEMICONDUCTORS_LB-Q39G_Series; Order_Code_Digikey: 475-2816-1-ND; ECCN_US: n/a; ECCN_EU: n/a; Order_Code_Farnell: N/A; Full_Alternate_Internal_Part_Number: MCD-02398
Q1-Q3 = MCD-02221: MOSFET N-CH 20V SC-89; Part_Preference: Recommended; Part_Type: Transistor; Manufacturer: VISHAY; Order_Code_RS: 812-3044; Component_Country_Of_Origin: Philippines; ID: 4321; ShowFields: YES; Internal_Part_Number: MCD-02221; Status: Checked; Package: SC-89; ComponentLink1Description: Part_Information; ComponentLink1URL: http://tunmcdsvn.tun.st.com/Component_Documentation_Library/Trunk/Transistor/VISHAY_SI1062X; Alternate_Manufacturer: N/A; Alternate_Manufacturer_Part_Number: N/A; Order_Code_Digikey: SI1062X-T1-GE3CT-ND; Order_Code_Farnell: 2646363
R33 = MCD-00053: Resistor,10K,0402,1%,1/16W; Manufacturer_Part_Number: RC0402FR-0710KL; Manufacturer: YAGEO; BMS_Part_Number: 9131590; Part_Preference: Recommended; Component_Country_Of_Origin: China; ID: 2539; ShowFields: YES; Internal_Part_Number: MCD-00053; ComponentLink1Description: Datasheet; Status: Released; Part_Type: Resistor; ComponentLink1URL: http://tunmcdsvn.tun.st.com/Component_Documentation_Library/Trunk/Resistor/YAGEO_RC_L_Series; Package: 0402; Order_Code_Digikey: 311-10.0KLRCT-ND; Order_Code_Farnell: 9239359; Order_Code_RS: N/A; Alternate_Manufacturer: N/A; Alternate_Manufacturer_Part_Number: N/A
R44 R122-R124 = MCD-00061: Resistor,1K,0402,1%,1/16W; Part_Preference: Recommended; Manufacturer: YAGEO; Manufacturer_Part_Number: RC0402FR-071KL; Component_Country_Of_Origin: China; ID: 2532; ShowFields: YES; Internal_Part_Number: MCD-00061; Status: Released; Part_Type: Resistor; Package: 0402; ComponentLink1Description: Datasheet; ComponentLink1URL: http://tunmcdsvn.tun.st.com/Component_Documentation_Library/Trunk/Resistor/YAGEO_RC_L_Series; Order_Code_Digikey: 311-1.00KLRCT-ND; Order_Code_Farnell: 9239235; Order_Code_RS: N/A; Alternate_Manufacturer: N/A; Alternate_Manufacturer_Part_Number: N/A
R126 R127 = MCD-00062: Resistor,330R,0402,1%,1/16W; Manufacturer_Part_Number: RC0402FR-07330RL; Manufacturer: YAGEO; Part_Preference: Recommended; Component_Country_Of_Origin: China; ID: 2529; ShowFields: YES; Internal_Part_Number: MCD-00062; Status: Released; Part_Type: Resistor; Package: 0402; ComponentLink1Description: Datasheet; ComponentLink1URL: http://tunmcdsvn.tun.st.com/Component_Documentation_Library/Trunk/Resistor/YAGEO_RC_L_Series; Order_Code_Digikey: 311-330LRCT-ND; Order_Code_Farnell: 9239170; Order_Code_RS: N/A; Alternate_Manufacturer: N/A; Alternate_Manufacturer_Part_Number: N/A
R128 R135 R137 R141 R143 = MCD-00059: Resistor,100K,0402,1%,1/16W; Manufacturer_Part_Number: RC0402FR-07100KL; Manufacturer: YAGEO; Alternate_Manufacturer_Part_Number: RT0402FRE07100KL; Part_Preference: Recommended; Partial_Alternate_Internal_Part_Number: MCD-03301; Component_Country_Of_Origin: China; ID: 2533; ShowFields: YES; Alternate_EMS: M; Internal_Part_Number: MCD-00059; Status: Released; Part_Type: Resistor; Alternate_Manufacturer: YAGEO; Package: 0402; ComponentLink1Description: Datasheet; ComponentLink1URL: http://tunmcdsvn.tun.st.com/Component_Documentation_Library/Trunk/Resistor/YAGEO_RC_L_Series; Order_Code_Digikey: 311-100KLRTR-ND; Order_Code_Farnell: 2421891; Order_Code_RS: N/A
R136 = MCD-00461: Resistor,360R,0402,1%,1/16W; Manufacturer_Part_Number: RC0402FR-07360RL; Manufacturer: YAGEO; Part_Preference: Recommended; Provided_By: SUBCO; ECCN_US: EAR99; ECCN_EU: NEC; Component_Country_Of_Origin: China; ID: 2816; ShowFields: YES; Internal_Part_Number: MCD-00461; Status: Released; Part_Type: Resistor; Package: 0402; ComponentLink1Description: Datasheet; ComponentLink1URL: http://tunmcdsvn.tun.st.com/Component_Documentation_Library/Trunk/Resistor/YAGEO_RC_L_Series; Order_Code_Digikey: YAG3132CT-ND; Order_Code_Farnell: 1458786; Order_Code_RS: N/A
R138 = MCD-00441: Resistor,270R,0402,1%,1/16W; Manufacturer_Part_Number: RC0402FR-07270RL; Manufacturer: YAGEO; Part_Preference: Recommended; Provided_By: SUBCO; ECCN_US: EAR99; ECCN_EU: NEC; Component_Country_Of_Origin: China; ID: 2838; ShowFields: YES; Internal_Part_Number: MCD-00441; Status: Released; Part_Type: Resistor; Package: 0402; ComponentLink1Description: Datasheet; ComponentLink1URL: http://tunmcdsvn.tun.st.com/Component_Documentation_Library/Trunk/Resistor/YAGEO_RC_L_Series; Order_Code_Digikey: 311-270LRCT-ND; Order_Code_Farnell: 9239162; Order_Code_RS: N/A
R139 = MCD-00061: Resistor, 1K, 0402, +/-1%,1/16W; Manufacturer_Part_Number: RC0402FR-071KL; Manufacturer: YAGEO; Part_Preference: Recommended; Component_Country_Of_Origin: China; ShowFields: YES; ID: 2532; Internal_Part_Number: MCD-00061; Status: Released; Part_Type: Resistor; ComponentLink1URL: http://tunmcdsvn.tun.st.com/Component_Documentation_Library/Trunk/Resistor/YAGEO_RC_L_Series; Package: 0402; Order_Code_Digikey: 311-1.00KLRCT-ND; Order_Code_Farnell: 9239235; Order_Code_RS: N/A
R140 = MCD-00067: Resistor, 100R, 0402, +/- 1%, 1/16W; Manufacturer_Part_Number: RC0402FR-07100RL; Manufacturer: YAGEO; Part_Preference: Recommended; Component_Country_Of_Origin: China; ShowFields: YES; ID: 2527; Internal_Part_Number: MCD-00067; Status: Released; Part_Type: Resistor; ComponentLink1URL: http://tunmcdsvn.tun.st.com/Component_Documentation_Library/Trunk/Resistor/YAGEO_RC_L_Series; Package: 0402; Order_Code_Digikey: 311-100LRCT-ND; Order_Code_Farnell: 9239111; Order_Code_RS: N/A
R142 = MCD-00449: Resistor,300R,0402,1%,1/16W; Manufacturer_Part_Number: RC0402FR-07300RL; Manufacturer: YAGEO; Part_Preference: Recommended; Provided_By: SUBCO; ECCN_US: EAR99; ECCN_EU: NEC; Component_Country_Of_Origin: China; ID: 2832; ShowFields: YES; Internal_Part_Number: MCD-00449; Status: Released; Part_Type: Resistor; Package: 0402; ComponentLink1Description: Datasheet; ComponentLink1URL: http://tunmcdsvn.tun.st.com/Component_Documentation_Library/Trunk/Resistor/YAGEO_RC_L_Series; Order_Code_Digikey: 311-300LRCT-ND; Order_Code_Farnell: 1458776; Order_Code_RS: N/A
R144 = MCD-00194: Resistor,120R,0402,1%,1/16W; Manufacturer_Part_Number: RC0402FR-07120RL; Manufacturer: YAGEO; Part_Preference: Recommended; Provided_By: SUBCO; ECCN_US: EAR99; ECCN_EU: NEC; Component_Country_Of_Origin: China; ID: 2674; ShowFields: YES; Internal_Part_Number: MCD-00194; Status: Released; Part_Type: Resistor; Package: 0402; ComponentLink1Description: Datasheet; ComponentLink1URL: http://tunmcdsvn.tun.st.com/Component_Documentation_Library/Trunk/Resistor/YAGEO_RC_L_Series; Order_Code_Digikey: 311-120LRCT-ND; Order_Code_Farnell: 9239120; Order_Code_RS: N/A
SW1 SW2 = MCD-00658: Dip Switch ,2Position ,Surface Mount Slide (Standard) ,2.54 pitch,25mA 24VDC; Part_Type: Misc; Part_Preference: Recommended; Manufacturer: C&K; Manufacturer_Part_Number: SDA02H1SBD; Component_Country_Of_Origin: Malaysia; ShowFields: YES; ID: 3090; Internal_Part_Number: MCD-00658; Value: SWITCH_2WAY; Status: Released; Package: DIP; ComponentLink1URL: http://tunmcdsvn.tun.st.com/Component_Documentation_Library/Trunk/Misc/C&K_SDA02H1SBD; Order_Code_Digikey: N/A; Order_Code_Farnell: N/A; Order_Code_RS: N/A
TP2-TP7 TP15 TP16 TP22-TP25 TP31 TP32 TP44 = MCD-00074: Test Point 1mm; Part_Type: Misc; Part_Preference: Recommended; Initial_Board_Reference: MB1274; ID: 2518; ShowFields: YES; Internal_Part_Number: MCD-00074; Status: Released; Manufacturer_Part_Number: n/a; Manufacturer: n/a; ComponentLink1Description: Datasheet; ComponentLink1URL: http://na; ECCN_US: n/a; ECCN_EU: n/a; Provided_By: n/a; Order_Code_Digikey: N/A; Order_Code_Farnell: N/A; Order_Code_RS: N/A
U15 U25 = MCD-03501: ESD protection , 0201; Part_Type: IC; Manufacturer: STMICROELECTRONICS; Part_Preference: Recommended; Order_Code_RS: 163-7318; ID: 5617; ShowFields: YES; Internal_Part_Number: MCD-03501; Status: New; Manufacturer_Part_Number: ESDZL5-1F4; ComponentLink1URL: http://tunmcdsvn.tun.st.com/Component_Documentation_Library/Trunk/IC/STMICROELECTRONICS_ESDZL5-1F4; Order_Code_Digikey: 497-17544-2-ND; Order_Code_Farnell: ESDZL5-1F4; Package: 0201; Full_Alternate_Internal_Part_Number: N/A
U27 = MCD-03501: ESD protection , 0201; Part_Type: IC; Part_Preference: Recommended; Manufacturer: STMICROELECTRONICS; Order_Code_RS: 163-7318; ShowFields: YES; ID: 5617; Internal_Part_Number: MCD-03501; Status: New; Manufacturer_Part_Number: ESDZL5-1F4; Package: 0201; ComponentLink1URL: http://tunmcdsvn.tun.st.com/Component_Documentation_Library/Trunk/IC/STMICROELECTRONICS_ESDZL5-1F4; Order_Code_Digikey: 497-17544-2-ND; Order_Code_Farnell: ESDZL5-1F4; Full_Alternate_Internal_Part_Number: N/A
U28 = MCD-00170: ESD protection 6V1; Part_Type: Diode; Manufacturer: STMICROELECTRONICS; BMS_Part_Number: 9151132; Part_Preference: Recommended; Manufacturer_HQ_COO: EU; Component_Country_Of_Origin: China; ID: 2696; ShowFields: YES; Internal_Part_Number: MCD-00170; Status: Released; Manufacturer_Part_Number: ESDALC6V1-1U2; ComponentLink1Description: Datasheet; ComponentLink1URL: http://tunmcdsvn.tun.st.com/Component_Datasheet_Library/Trunk/Diodes/STM_ESD_ESDALC6V1-1U2